# Altium schematic sheet Hex_Link_Trans.SchDoc
size A3
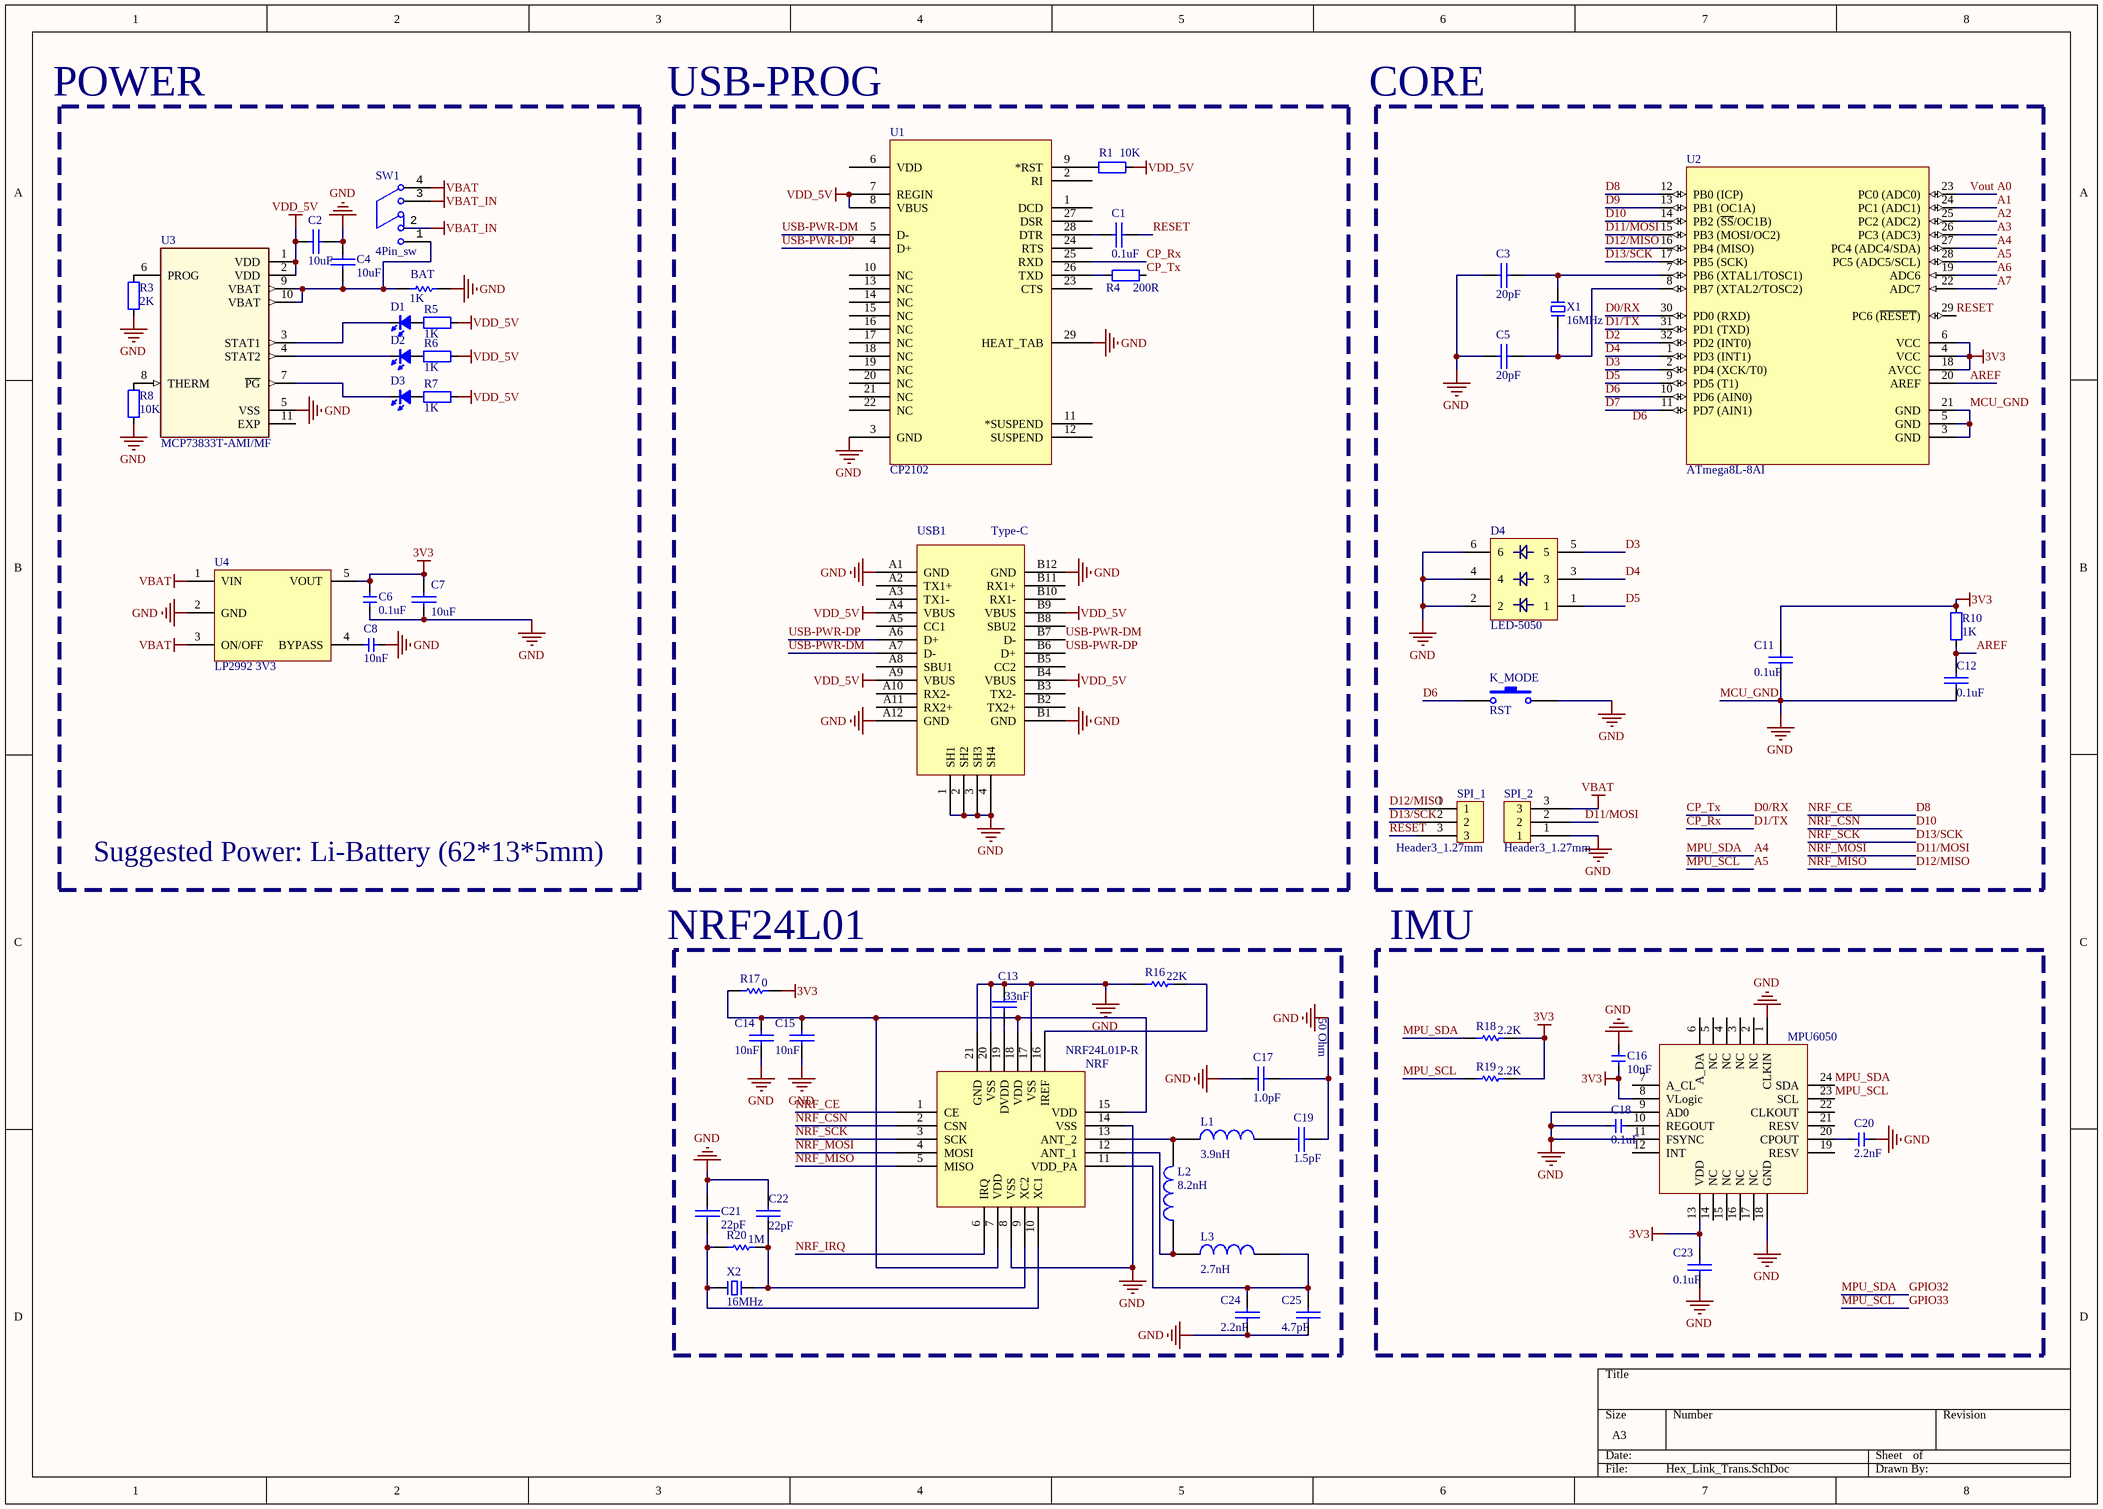
[diagram p0: Hex_Link_Trans.SchDoc]

## Parts
BAT  1K  [RES_0402]
C1  0.1uF  [CAP_0402]
C2  10uF  [CAP_0402]
C3  20pF  [CAP_0402]
C4  10uF  [CAP_0402]
C5  20pF  [CAP_0402]
C6  0.1uF  [CAP_0402]
C7  10uF  [CAP_0402]
C8  10nF  [CAP_0402]
C11  0.1uF  [CAP_0402]
C12  0.1uF  [CAP_0402]
C13  33nF  [CAP_0402]
C14  10nF  [CAP_0402]
C15  10nF  [CAP_0402]
C16  10nF  [CAP_0402]
C17  1.0pF  [CAP_0402]
C18  0.1uF  [CAP_0402]
C19  1.5pF  [CAP_0402]
C20  2.2nF  [CAP_0402]
C21  22pF  [CAP_0402]
C22  22pF  [CAP_0402]
C23  0.1uF  [CAP_0402]
C24  2.2nF  [CAP_0402]
C25  4.7pF  [CAP_0402]
D1  color?  [LED_0402_RED]  (value not drawn)
D2  color?  [LED_0402_RED]  (value not drawn)
D3  color?  [LED_0402_RED]  (value not drawn)
D4  LED-5050  [LED-5050W]
K_MODE  RST  [SW_PB]
L1  3.9nH  [0402L_2]
L2  8.2nH  [0402L_2]
L3  2.7nH  [0402L_2]
NRF  NRF24L01P-R  [QFN20]
R1  10K  [RES_0402]
R3  2K  [RES_0402]
R4  200R  [RES_0402]
R5  1K  [RES_0402]
R6  1K  [RES_0402]
R7  1K  [RES_0402]
R8  10K  [RES_0402]
R10  1K  [RES_0402]
R16  22K  [RES_0402]
R17  0  [RES_0402]
R18  2.2K  [RES_0402]
R19  2.2K  [RES_0402]
R20  1M  [RES_0402]
SPI_1  Header3_1.27mm  [HEADER3_1.27mm]
SPI_2  Header3_1.27mm  [HEADER3_1.27mm]
SW1  4Pin_sw  [4pin_SW]
U1  CP2102  [QFN-28]
U2  ATmega8L-8AI  [32A_N]
U3  MCP73833T-AMI/MF  [QFN_10_L]
U4  LP2992 3V3  [SOT23-5]
U5  MPU6050  [QFN-24]
USB1  Type-C  [Type-C-TOP]
X1  16MHz  [OSC 5032-2P]
X2  16MHz  [OSC 5032-2P]

## Blocks framed on the sheet
Suggested Power: Li-Battery (62*13*5mm): BAT C2 C4 C6-C8 D1-D3 R3 R5-R8 SW1 U3 U4
50 Ohm: C13-C15 C17 C19 C21 C22 C24 C25 L1-L3 NRF R16 R17 R20 X2
IMU: C16 C18 C20 C23 R18 R19 U5

## Nets
3V3: C6.1 C7.1 C11.1 C16.1 C23.1 R10.1 R17.2 R18.2 R19.2 U2.4(VCC) U2.6(VCC) U2.18(AVCC) U4.5(VOUT) U5.8(VLogic) U5.13(VDD)
MCU_GND: BAT.2 C2.2 C3.2 C4.1 C5.2 C6.2 C7.2 C8.1 C11.2 C12.2 C13.1 C14.2 C15.2 C16.2 C17.1 C17.2 C18.2 C19.2 C20.1 C21.2 C22.1 C23.2 C24.2 C25.2 D4.2 D4.4 D4.6 K_MODE.2 NRF.8(VSS) NRF.14(VSS) NRF.17(VSS) NRF.20(VSS) NRF.21(GND) R3.1 R8.1 R16.1 SPI_2.1 U1.3(GND) U1.29(HEAT_TAB) U2.3(GND) U2.5(GND) U2.21(GND) U3.5(VSS) U4.2(GND) U5.1(CLKIN) U5.9(AD0) U5.11(FSYNC) U5.18(GND) USB1.1(SH1) USB1.2(SH2) USB1.3(SH3) USB1.4(SH4) USB1.A1(GND) USB1.A12(GND) USB1.B1(GND) USB1.B12(GND)  [also labelled GND]
VBAT: SPI_2.3 SW1.4 U4.1(VIN) U4.3(ON/OFF)
VBAT_IN: SW1.2 SW1.3
VDD_5V: C2.1 R1.1 R5.1 R6.1 R7.1 U1.7(REGIN) U1.8(VBUS) U3.1(VDD) U3.2(VDD) USB1.A4(VBUS) USB1.A9(VBUS) USB1.B4(VBUS) USB1.B9(VBUS)
A0: U2.23(PC0_(ADC0))  [also labelled Vout]
A1: U2.24(PC1_(ADC1))
A2: U2.25(PC2_(ADC2))
A3: U2.26(PC3_(ADC3))
A4: R18.1 U2.27(PC4_(ADC4/SDA)) U5.24(SDA)  [also labelled GPIO32, MPU_SDA]
A5: R19.1 U2.28(PC5_(ADC5/SCL)) U5.23(SCL)  [also labelled GPIO33, MPU_SCL]
A6: U2.19(ADC6)
A7: U2.22(ADC7)
AREF: C12.1 R10.2 U2.20(AREF)
CP_Rx: U1.25(RXD) U2.31(PD1_(TXD))  [also labelled D1/TX]
CP_Tx: R4.1 U2.30(PD0_(RXD))  [also labelled D0/RX]
D2: U2.32(PD2_(INT0))
D3: D4.5 U2.2(PD4_(XCK/T0))
D4: D4.3 U2.1(PD3_(INT1))
D5: D4.1 U2.9(PD5_(T1))
D6: K_MODE.1 U2.10(PD6_(AIN0))
D7: U2.11(PD7_(AIN1))
D8: NRF.1(CE) U2.12(PB0_(ICP))  [also labelled NRF_CE]
D9: U2.13(PB1_(OC1A))
D10: NRF.2(CSN) U2.14(PB2_(~{SS}/OC1B))  [also labelled NRF_CSN]
D11/MOSI: NRF.4(MOSI) SPI_2.2 U2.15(PB3_(MOSI/OC2))  [also labelled NRF_MOSI]
D12/MISO: NRF.5(MISO) SPI_1.1 U2.16(PB4_(MISO))  [also labelled NRF_MISO]
D13/SCK: NRF.3(SCK) SPI_1.2 U2.17(PB5_(SCK))  [also labelled NRF_SCK]
NRF_IRQ: NRF.6(IRQ)
RESET: C1.1 SPI_1.3 U2.29(PC6_(~{RESET}))
USB-PWR-DM: U1.5(D-) USB1.A7(D-) USB1.B7(D-)
USB-PWR-DP: U1.4(D+) USB1.A6(D+) USB1.B6(D+)
NetBAT_1: BAT.1 C4.2 SW1.1 U3.9(VBAT) U3.10(VBAT)
NetC1_2: C1.2 U1.28(DTR)
NetC3_1: C3.1 U2.7(PB6_(XTAL1/TOSC1)) X1.2
NetC5_1: C5.1 U2.8(PB7_(XTAL2/TOSC2)) X1.1
NetC8_2: C8.2 U4.4(BYPASS)
NetC13_2: C13.2 NRF.19(DVDD)
NetC14_1: C14.1 C15.1 NRF.7(VDD) NRF.15(VDD) NRF.18(VDD) R17.1
NetC18_1: C18.1 U5.10(REGOUT)
NetC19_1: C19.1 L1.2
NetC20_2: C20.2 U5.20(CPOUT)
NetC21_1: C21.1 NRF.10(XC1) R20.1 X2.1
NetC22_2: C22.2 NRF.9(XC2) R20.2 X2.2
NetC24_1: C24.1 C25.1 L3.2 NRF.11(VDD_PA)
NetD1_1: D1.1(A) R5.2
NetD1_2: D1.2(K) U3.3(STAT1)
NetD2_1: D2.1(A) R6.2
NetD2_2: D2.2(K) U3.4(STAT2)
NetD3_1: D3.1(A) R7.2
NetD3_2: D3.2(K) U3.7(~{PG})
NetL1_1: L1.1 L2.2 NRF.13(ANT_2)
NetL2_1: L2.1 L3.1 NRF.12(ANT_1)
NetNRF_16: NRF.16(IREF) R16.2
NetR1_2: R1.2 U1.9(*RST)
NetR3_2: R3.2 U3.6(PROG)
NetR4_2: R4.2 U1.26(TXD)
NetR8_2: R8.2 U3.8(THERM)

Not connected (* = marked no-connect by the designer): U1 1(DCD) 2(RI) 6(VDD) 10(NC) 11(*SUSPEND) 12(SUSPEND) 13(NC) 14(NC) 15(NC) 16(NC) 17(NC) 18(NC) 19(NC) 20(NC) 21(NC) 22(NC) 23(CTS) 24(RTS) 27(DSR); U3 11(EXP); U5 2(NC) 3(NC) 4(NC) 5(NC) 6(A_DA) 7(A_CL) 12(INT) 14(NC) 15(NC) 16(NC) 17(NC) 19(RESV) 21(RESV) 22(CLKOUT); USB1 A2(TX1+) A3(TX1-) A5(CC1) A8(SBU1) A10(RX2-) A11(RX2+) B2(TX2+) B3(TX2-) B5(CC2) B8(SBU2) B10(RX1-) B11(RX1+)

## Notes on the sheet
- POWER
- USB-PROG
- CORE
- (near R17) NRF24L01
- Labels drawn without touching a wire or pin: D6

## Library data of the parts
BAT R16-R20 = RES
C1-C5 C7 C11-C15 C17 C19 C21-C25 = CAP: 无极性电容
C6 C8 C16 C18 C20 = 电容-0402: Capacitor; Value: 0.1u
D1-D3 = LED_0402: LED; Type: 0402; Value: color?
K_MODE = SW-PB: Switch; Published: 24-Mar-1999; LatestRevisionDate: 17-Jul-2002; LatestRevisionNote: Re-released for DXP Platform.; PackageReference: SPST-2; Publisher: Altium Limited; PackageDescription: Switch; 2 Leads
L1-L3 = INDUCTOR
R1 R3-R8 R10 = 电阻-0402: Resistor; Value: 22R
U1 = CP2102: USB转TTL; PART DESC: SINGLE-CHIP USB TO UART BRIDGE, QFN28, RoHS.; MFG #1: SILICON LABS; PART NUMBER: CP2102; Value: Value; RefDes: RefDes; Type: DEV
U2 = ATmega8L-8AI: 8-Bit AVR Microcontroller with 8K Bytes of In-System Programmable Flash Memory; Published: 17-Sep-2003; LatestRevisionDate: 13-Apr-2006; LatestRevisionNote: IPC-7351 Footprint Added.; DatasheetVersion: 2486H-AVR-09/02; PackageVersion: revB, Oct-2001; PackageReference: 32A; Publisher: Altium Limited; PackageDescription: 32-Pin Thin Quad Flat Pack 0.8 mm Pitch; Code_JEDEC: MS-026-ABA; ComponentLink1Description: Manufacturer Link; ComponentLink1URL: http://www.atmel.com; ComponentLink2Description: Datasheet; ComponentLink2URL: http://www.atmel.com/dyn/resources/prod_documents/doc2486.pdf
U3 = MCP73833T: Linear Charge Management Controller Li-Ion/Li-Pol 1mA 4.2V/4.35V/4.4V/4.5V 10-Pin DFN EP T/R; MF: Microchip; Availability: Unavailable; Package: DFN-10 Microchip; Price: None; SnapEDA_Link: https://www.snapeda.com/parts/MCP73833T-AMI/MF/Microchip/view-part/?ref=snap; MP: MCP73833T-AMI/MF; Value: *
U4 = LP2992: LDO
U5 = MPU6050: 六轴传感器
USB1 = USB-Type-C-TOP
X1 X2 = XTAL-2P: 2脚无源脚晶振